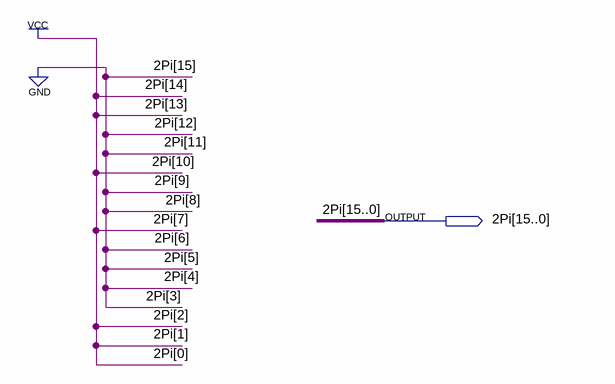
[diagram p0: schematic sheet]
// Quartus schematic 2Pi.bdf as structural Verilog: 0 symbols, 1 pins
module \2Pi  (
  output [15:0] \2Pi 
);


  assign \2Pi  = 16'b0110010010000111;
endmodule
